# Altium project first_project.PrjPcb
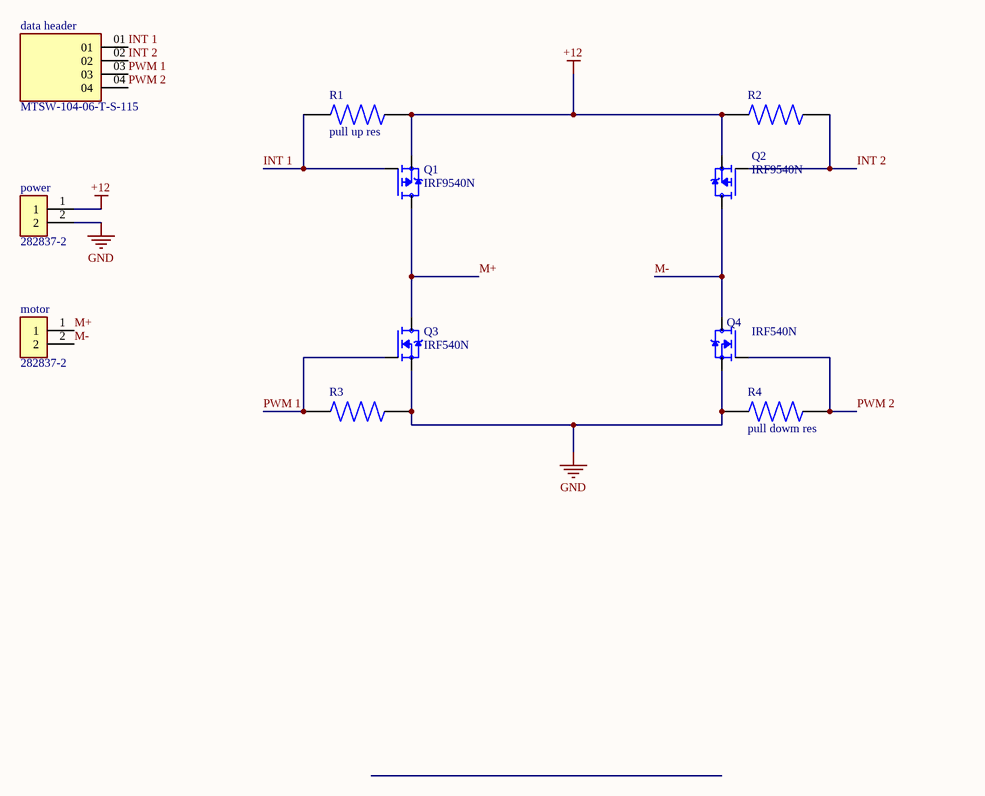
[diagram p0: Sheet1.SchDoc]
1 sheet, 11 parts. Net scope: global (net labels, ports and power ports of the same name join across sheets).
Board file: PCB1.PcbDoc

## Sheet Sheet1.SchDoc
size A; SheetNumber: 1; SheetTotal: 1

### Parts
data_header  MTSW-104-06-T-S-115  [SAMTEC_MTSW-104-06-T-S-115]
motor  282837-2  [TE_282837-2]
power  282837-2  [TE_282837-2]
Q1  IRF9540N  [TO254P1041X444X1930-3]
Q2  IRF9540N  [TO254P1041X444X1930-3]
Q3  IRF540N  [TO254P1054X469X1930-3]
Q4  IRF540N  [TO254P1054X469X1930-3]
R1  pull up res  [RESAD1100W55L680D260]
R2  pull up rs  [RESAD1100W55L680D260]  (value not drawn)
R3  pull down res  [RESAD1100W55L680D260]  (value not drawn)
R4  pull dowm res  [RESAD1100W55L680D260]

### Nets
+12: power.1 Q1.3(S) Q2.3(S) R1.2 R2.1
GND: power.2 Q3.3(S) Q4.3(S) R3.2 R4.1
INT 1: data_header.01 Q1.1(G) R1.1
INT 2: data_header.02 Q2.1(G) R2.2
M+: motor.1 Q1.2(D) Q3.2(D)
M-: motor.2 Q2.2(D) Q4.2(D)
PWM 1: data_header.03 Q3.1(G) R3.1
PWM 2: data_header.04 Q4.1(G) R4.2

### Library data of the parts
motor power = 282837-2: Ð Ð°Ð·ÑŠÐµÐ¼Ð½Ñ‹Ðµ ÐºÐ»ÐµÐ¼Ð¼Ð½Ñ‹Ðµ ÐºÐ¾Ð»Ð¾Ð´ÐºÐ¸ Ð Ð¾Ð·ÐµÑ‚ÐºÐ° 2 Ð¿Ð¾Ð»Ð¾Ð¶ÐµÐ½Ð¸Ñ 5,08 Ð¼Ð¼ ÐŸÑ€Ð¸Ð¿Ð¾Ð¹ Ð¿Ñ€ÑÐ¼Ð¾Ð¹ Ñ‡ÐµÑ€ÐµÐ· Ð¾Ñ‚Ð²ÐµÑ€ÑÑ‚Ð¸Ðµ 13,5 Ð / ÐºÐ¾Ð½Ñ‚Ð°ÐºÑ‚; MF: TE Connectivity; SnapEDA_Link: https://www.snapeda.com/parts/282837-2/TE+Connectivity+AMP+Connectors/view-part/?ref=snap; Price: None; Check_prices: https://www.snapeda.com/parts/282837-2/TE+Connectivity+AMP+Connectors/view-part/?ref=eda; Purchase-URL: https://pricing.snapeda.com/search/part/282837-2/?ref=eda; MP: 282837-2; Value: *; Availability: In Stock; Package: None
Q1 Q2 = IRF9540N: P-Channel 100 V 23A (Tc) 3.1W (Ta), 110W (Tc); MF: Infineon Technologies; Value: *; Purchase-URL: https://pricing.snapeda.com/search/part/IRF9540N/?ref=eda; Package: TO-220 Infineon; MP: IRF9540N; Check_prices: https://www.snapeda.com/parts/IRF9540N/Infineon+Technologies/view-part/?ref=eda; SnapEDA_Link: https://www.snapeda.com/parts/IRF9540N/Infineon+Technologies/view-part/?ref=snap; Price: None; Availability: In Stock
Q3 Q4 = IRF540N: Transistor NPN MOS IRF540/IRF540N INTERNATIONAL RECTIFIER Ampere=28 V=100 TO220; MF: Infineon Technologies; Package: Package; MP: IRF540N; Price: None; Availability: Not in stock; Value: *; Check_prices: https://www.snapeda.com/parts/IRF540N/Infineon+Technologies/view-part/?ref=eda; SnapEDA_Link: https://www.snapeda.com/parts/IRF540N/Infineon+Technologies/view-part/?ref=snap
R1-R4 = MFR-25FBF52-10K: 10.2 kOhms Â±1% 0.25W, 1/4W Through Hole Resistor Axial - Metal Film; MF: Yageo; SnapEDA_Link: https://www.snapeda.com/parts/MFR-25FBF52-10K/Yageo/view-part/?ref=snap; Availability: In Stock; Price: None; Value: *; Check_prices: https://www.snapeda.com/parts/MFR-25FBF52-10K/Yageo/view-part/?ref=eda; Purchase-URL: https://pricing.snapeda.com/search/part/MFR-25FBF52-10K/?ref=eda; MP: MFR-25FBF52-10K; Package: Axial Yageo
data_header = MTSW-104-06-T-S-115: MP: MTSW-104-06-T-S-115; Price: None; Value: *; Availability: Unavailable; Package: None